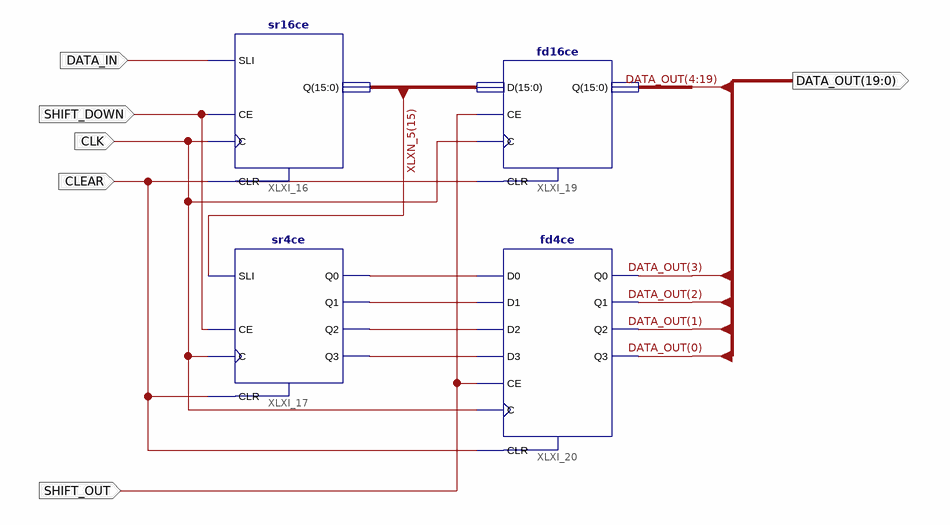
[diagram p0: schematic sheet 1]
// Xilinx ISE schematic serparbuf.sch (xbr) as structural Verilog: 4 symbols, 6 ports
module serparbuf (
  input  DATA_IN,
  input  CLEAR,
  input  CLK,
  input  SHIFT_DOWN,
  input  SHIFT_OUT,
  output [19:0] DATA_OUT
);

  wire XLXN_8, XLXN_9, XLXN_10, XLXN_11;
  wire [15:0] XLXN_5;

  sr16ce XLXI_16 (.C(CLK), .CE(SHIFT_DOWN), .CLR(CLEAR), .SLI(DATA_IN), .Q(XLXN_5));
  sr4ce XLXI_17 (
    .C(CLK), .CE(SHIFT_DOWN), .CLR(CLEAR), .SLI(XLXN_5[15]), .Q0(XLXN_8), .Q1(XLXN_9), .Q2(XLXN_10),
    .Q3(XLXN_11));
  fd16ce XLXI_19 (
    .C(CLK), .CE(SHIFT_OUT), .CLR(CLEAR), .D(XLXN_5),
    .Q({DATA_OUT[4], DATA_OUT[5], DATA_OUT[6], DATA_OUT[7], DATA_OUT[8], DATA_OUT[9], DATA_OUT[10], DATA_OUT[11], DATA_OUT[12], DATA_OUT[13], DATA_OUT[14], DATA_OUT[15], DATA_OUT[16], DATA_OUT[17], DATA_OUT[18], DATA_OUT[19]}));
  fd4ce XLXI_20 (
    .C(CLK), .CE(SHIFT_OUT), .CLR(CLEAR), .D0(XLXN_8), .D1(XLXN_9), .D2(XLXN_10), .D3(XLXN_11),
    .Q0(DATA_OUT[3]), .Q1(DATA_OUT[2]), .Q2(DATA_OUT[1]), .Q3(DATA_OUT[0]));
endmodule
